# Altium project wikiduino-ap8264.PrjPCB
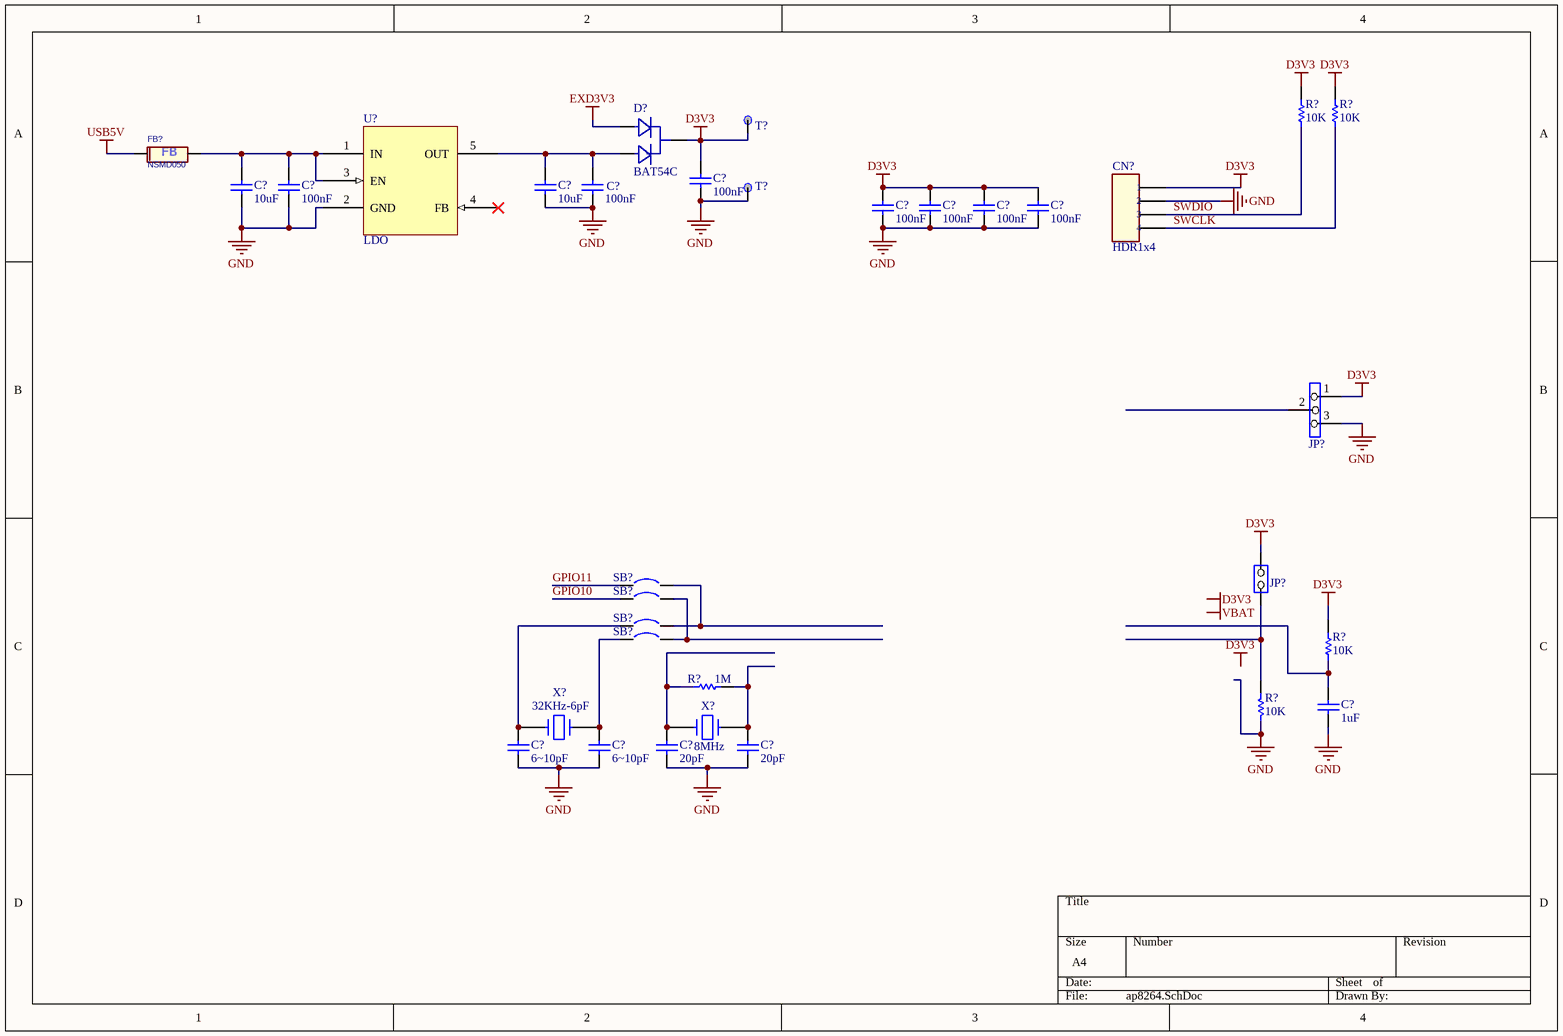
[diagram p0: ap8264.SchDoc]
1 sheet, 33 parts. Net scope: global (net labels, ports and power ports of the same name join across sheets).

## Sheet ap8264.SchDoc
size A4

### Parts
(Parts that share a designator on the sheet are numbered #1, #2 ... from top to bottom, then left to right.)
C?#1  100nF  [C0603L]
C?#2  10uF  [C0805]
C?#3  100nF  [C0603L]
C?#4  10uF  [C0805]
C?#5  100nF  [C0603L]
C?#6  100nF  [C0603L]
C?#7  100nF  [C0603L]
C?#8  100nF  [C0603L]
C?#9  100nF  [C0603L]
C?#10  1uF  [C0603L]
C?#11  6~10pF  [C0603L]
C?#12  6~10pF  [C0603L]
C?#13  20pF  [C0603L]
C?#14  20pF  [C0603L]
CN?  HDR1x4  [HDR1x4]
D?  BAT54C  [BAT54C]
FB?  NSMD050  [R1206]
JP?#1  Jumper3  [HDR1X3/2.00mm]  (value not drawn)
JP?#2  Jumper2-2  [HDR1X2/2.00MM]  (value not drawn)
R?#1  10K  [R0603]
R?#2  10K  [R0603]
R?#3  10K  [R0603]
R?#4  1M  [R0603]
R?#5  10K  [R0603]
SB?#1  Circuit Breaker  [JP2_SMD]  (value not drawn)
SB?#2  Circuit Breaker  [JP2_SMD]  (value not drawn)
SB?#3  Circuit Breaker  [JP2_SMD]  (value not drawn)
SB?#4  Circuit Breaker  [JP2_SMD]  (value not drawn)
T?#1  TP  [TP]  (value not drawn)
T?#2  TP  [TP]  (value not drawn)
U?  LDO  [SOT23-5]
X?#1  32KHz-6pF  [XTAL0602]
X?#2  8MHz  [XTAL_socket]

### Nets
D3V3: C?#1.1 C?#6.1 C?#7.1 C?#8.1 C?#9.1 CN?.1 D?.3 JP?#1.1 JP?#2.2(NO) R?#1.2 R?#2.2 R?#3.2 T?#1.1
EXD3V3: D?.2
GND: C?#1.2 C?#2.2 C?#3.2 C?#4.2 C?#5.2 C?#6.2 C?#7.2 C?#8.2 C?#9.2 C?#10.2 C?#11.2 C?#12.2 C?#13.2 C?#14.2 CN?.2 JP?#1.3 R?#5.1 T?#2.1 U?.2(GND)
USB5V: FB?.1
GPIO10: SB?#2.1
GPIO11: SB?#1.1
SWCLK: CN?.4 R?#2.1
SWDIO: CN?.3 R?#1.1
NetC?#2_1: C?#2.1 C?#3.1 FB?.2 U?.1(IN) U?.3(EN)
NetC?#4_1: C?#4.1 C?#5.1 D?.1 U?.5(OUT)
NetC?#10_1: C?#10.1 R?#3.1
NetC?#11_1: C?#11.1 SB?#3.1 X?#1.2
NetC?#12_1: C?#12.1 SB?#4.1 X?#1.1
NetC?#13_1: C?#13.1 R?#4.1 X?#2.2
NetC?#14_1: C?#14.1 R?#4.2 X?#2.1
NetJP?#2_1: JP?#2.1(COMMON) R?#5.2
NetSB?#1_2: SB?#1.2 SB?#3.2
NetSB?#2_2: SB?#2.2 SB?#4.2

Not connected (* = marked no-connect by the designer): JP?#1 2; U? 4(FB)*

### Notes on the sheet
- Labels drawn without touching a wire or pin: D3V3, VBAT

### Library data of the parts
C?#1-C?#14 = Cap: Capacitor; Published: 8-Jun-2000; LatestRevisionDate: 17-Jul-2002; LatestRevisionNote: Re-released for DXP Platform.; PackageReference: RAD-0.3; Publisher: Altium Limited
  C?#1 C?#3 C?#5-C?#9: Value: 100nF
  C?#2 C?#4: Value: 10uF
  C?#10: Value: 1uF
  C?#11 C?#12: Value: 6~10pF
  C?#13 C?#14: Value: 20pF
CN? = CON4
D? = BAT54C: DOUBLE SHOTTKEY DIODES
FB? = FB: Ferrite Beads Inductors Impedance:120Ω±25% Rated Current:1500mA DC Resistance:0.095Ω; Manufacturer: muRata; Manufacturer Part Number: BLM15EG121SN1
JP?#2 = Jumper2-2: Jumper2
R?#1-R?#5 = RES: Resistor; Design Item Id: RES-50R-1%-0805
SB?#1-SB?#4 = Circuit Breaker: Solder: YES; Published: 24-Mar-1999; Revision: July-2002: Re-released for DXP Platform.; Publisher: Altium Limited
T?#1 T?#2 = TP: Test Point
U? = LDO-SOT23-5: General LDO SOT23-5
X?#1 X?#2 = CRYSTAL